# Altium schematic sheet cover_page.SchDoc
size A4; Date: 1/11/16; Engineer: JBayalas; DocumentNumber: 1; Revision: V4.3.0; SheetNumber: 1; SheetTotal: 12
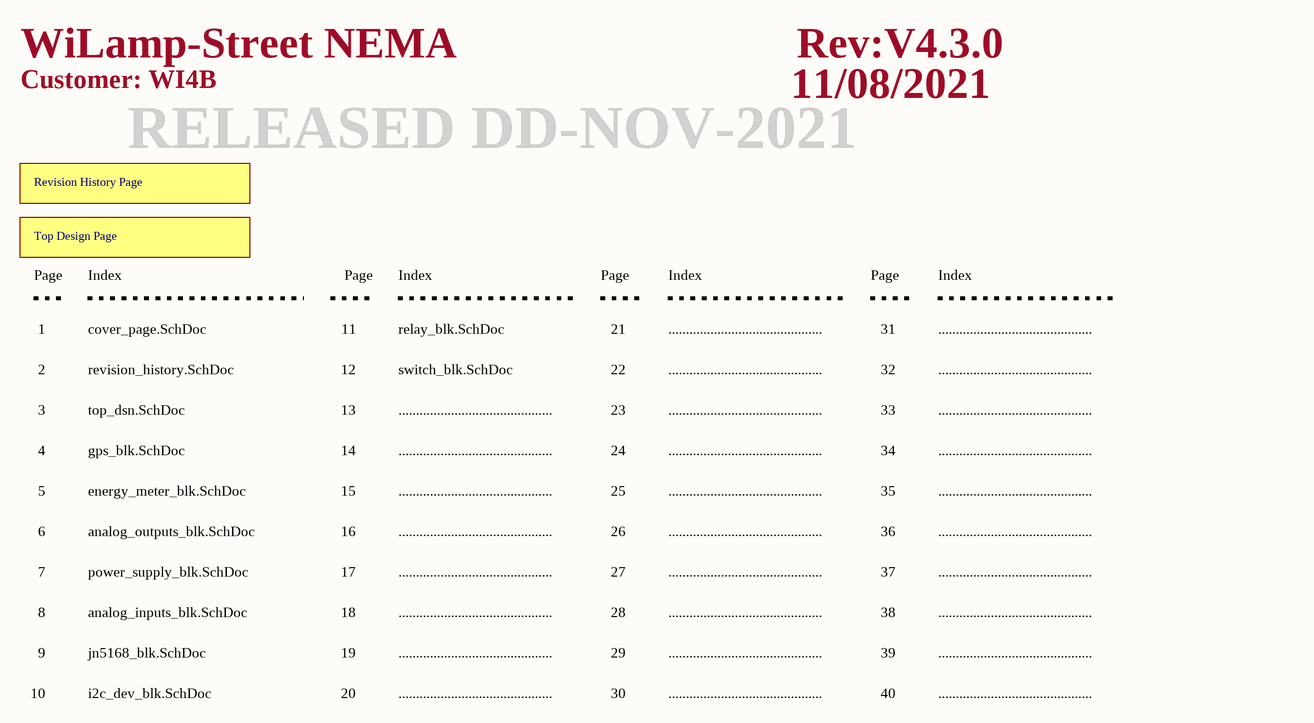
[diagram p0: cover_page.SchDoc]

## Sub-sheets
Revision History Page = revision_history.SchDoc: no entries
Top Design Page = top_dsn.SchDoc: no entries

## Notes on the sheet
- WiLamp-Street NEMA
- Rev:V4.3.0
- Customer: WI4B
- 11/08/2021
- RELEASED DD-NOV-2021
- Page
- Index
- 1
- cover_page.SchDoc
- 11
- relay_blk.SchDoc
- 21
- ............................................
- 31
- 2
- 3
- revision_history.SchDoc
- top_dsn.SchDoc
- 12
- 13
- switch_blk.SchDoc
- 22
- 23
- 32
- 33
- 4
- gps_blk.SchDoc
- 14
- 24
- 34
- 5
- 6
- analog_outputs_blk.SchDoc
- energy_meter_blk.SchDoc
- 15
- 16
- 25
- 26
- 35
- 36
- 7
- 8
- power_supply_blk.SchDoc
- analog_inputs_blk.SchDoc
- 17
- 18
- 27
- 28
- 37
- 38
- 9
- jn5168_blk.SchDoc
- 19
- 29
- 39
- 10
- i2c_dev_blk.SchDoc
- 20
- 30
- 40
- Title:
- Sheet:
- Date:
- of
- Project:
- Revision:
- Engineer:
- Wi4B S.r.l